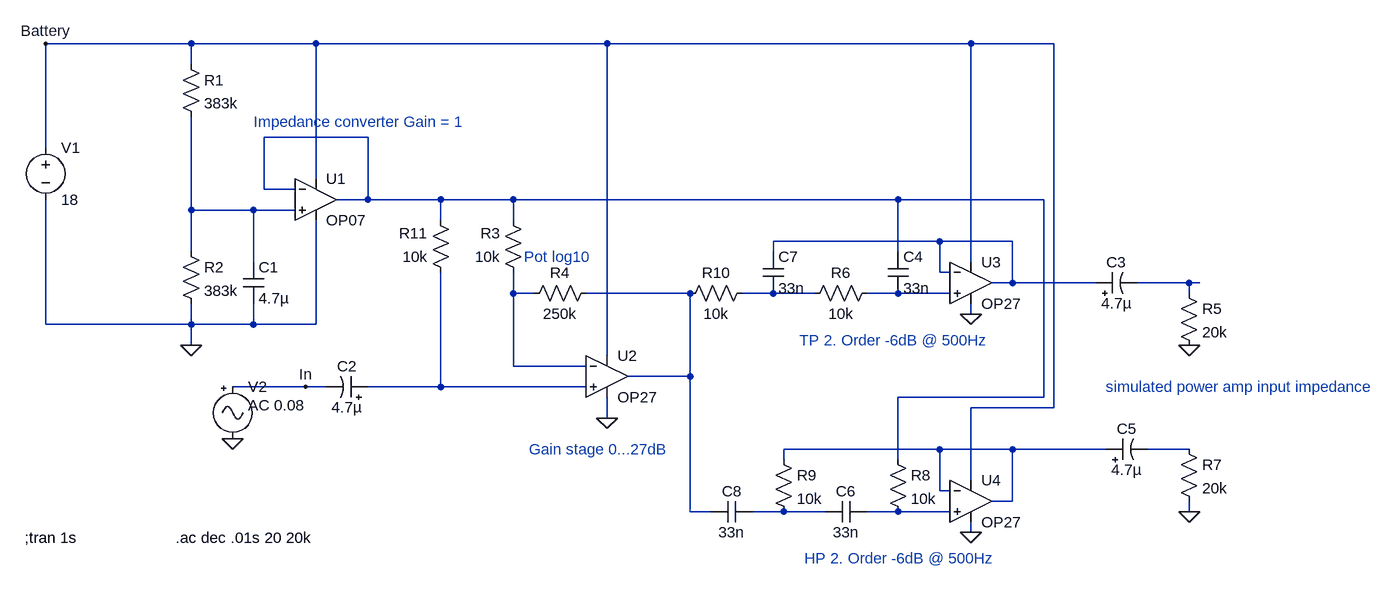
[diagram p0: schematic Preamp_HighLowPass2ndOrder_SMD.asc]
Preamp_HighLowPass2ndOrder_SMD.asc, the LTspice schematic file:
Version 4
SHEET 1 1816 680
WIRE -48 -624 -272 -624
WIRE 144 -624 -48 -624
WIRE 592 -624 144 -624
WIRE 1152 -624 592 -624
WIRE 1280 -624 1152 -624
WIRE -48 -592 -48 -624
WIRE 224 -480 64 -480
WIRE -272 -464 -272 -624
WIRE 144 -416 144 -624
WIRE 64 -400 64 -480
WIRE 112 -400 64 -400
WIRE 224 -384 224 -480
WIRE 224 -384 176 -384
WIRE 336 -384 224 -384
WIRE 448 -384 336 -384
WIRE 1040 -384 448 -384
WIRE 1264 -384 1040 -384
WIRE -48 -368 -48 -512
WIRE 48 -368 -48 -368
WIRE 112 -368 48 -368
WIRE 336 -352 336 -384
WIRE 448 -352 448 -384
WIRE 1104 -320 848 -320
WIRE 1216 -320 1104 -320
WIRE -48 -304 -48 -368
WIRE 848 -304 848 -320
WIRE 1040 -304 1040 -384
WIRE 48 -288 48 -368
WIRE 1152 -288 1152 -624
WIRE 1104 -272 1104 -320
WIRE 1120 -272 1104 -272
WIRE 1216 -256 1216 -320
WIRE 1216 -256 1184 -256
WIRE 1344 -256 1216 -256
WIRE 1488 -256 1408 -256
WIRE 1504 -256 1488 -256
WIRE 448 -240 448 -272
WIRE 480 -240 448 -240
WIRE 720 -240 560 -240
WIRE 848 -240 800 -240
WIRE 912 -240 848 -240
WIRE 1040 -240 992 -240
WIRE 1120 -240 1040 -240
WIRE 1488 -240 1488 -256
WIRE 1152 -208 1152 -224
WIRE -272 -192 -272 -384
WIRE -48 -192 -48 -224
WIRE -48 -192 -272 -192
WIRE 48 -192 48 -224
WIRE 48 -192 -48 -192
WIRE 144 -192 144 -352
WIRE 144 -192 48 -192
WIRE -48 -160 -48 -192
WIRE 592 -144 592 -624
WIRE 448 -128 448 -240
WIRE 560 -128 448 -128
WIRE 720 -112 720 -240
WIRE 720 -112 624 -112
WIRE 128 -96 16 -96
WIRE 160 -96 128 -96
WIRE 336 -96 336 -272
WIRE 336 -96 224 -96
WIRE 560 -96 336 -96
WIRE 1264 -80 1264 -384
WIRE 1264 -80 1040 -80
WIRE 1280 -64 1280 -624
WIRE 1280 -64 1152 -64
WIRE 592 -48 592 -80
WIRE 1104 0 864 0
WIRE 1216 0 1104 0
WIRE 1360 0 1216 0
WIRE 1488 0 1424 0
WIRE 864 16 864 0
WIRE 1040 16 1040 -80
WIRE 1152 48 1152 -64
WIRE 1104 64 1104 0
WIRE 1120 64 1104 64
WIRE 1216 80 1216 0
WIRE 1216 80 1184 80
WIRE 720 96 720 -112
WIRE 752 96 720 96
WIRE 864 96 816 96
WIRE 928 96 864 96
WIRE 1040 96 992 96
WIRE 1120 96 1040 96
WIRE 1488 96 1488 80
WIRE 1152 128 1152 112
FLAG -48 -160 0
FLAG 592 -48 0
FLAG 1152 -208 0
FLAG 16 -16 0
FLAG 1152 128 0
FLAG 1488 -160 0
FLAG 1488 96 0
FLAG -272 -624 Battery
FLAG 128 -96 In
SYMBOL res -64 -608 R0
SYMATTR InstName R1
SYMATTR Value 383k
SYMBOL res -64 -320 R0
SYMATTR InstName R2
SYMATTR Value 383k
SYMBOL voltage -272 -480 R0
SYMATTR InstName V1
SYMATTR Value 18
SYMBOL OpAmps\\OP07 144 -448 R0
SYMATTR InstName U1
SYMBOL cap 32 -288 R0
SYMATTR InstName C1
SYMATTR Value 4.7µ
SYMBOL res 464 -256 R180
WINDOW 0 36 76 Left 2
WINDOW 3 36 40 Left 2
SYMATTR InstName R3
SYMATTR Value 10k
SYMATTR SpiceLine tol=1 pwr=250m
SYMBOL res 576 -256 R90
WINDOW 0 0 56 VBottom 2
WINDOW 3 32 56 VTop 2
SYMATTR InstName R4
SYMATTR Value 250k
SYMBOL polcap 224 -80 M270
WINDOW 0 32 32 VTop 2
WINDOW 3 0 32 VBottom 2
SYMATTR InstName C2
SYMATTR Value 4.7µ
SYMBOL OpAmps\\OP27 592 -176 R0
SYMATTR InstName U2
SYMBOL OpAmps\\OP27 1152 -320 R0
SYMATTR InstName U3
SYMBOL res 1008 -256 R90
WINDOW 0 0 56 VBottom 2
WINDOW 3 32 56 VTop 2
SYMATTR InstName R6
SYMATTR Value 10k
SYMBOL cap 1024 -304 R0
SYMATTR InstName C4
SYMATTR Value 33n
SYMBOL OpAmps\\OP27 1152 16 R0
SYMATTR InstName U4
SYMBOL cap 992 80 R90
WINDOW 0 0 32 VBottom 2
WINDOW 3 32 32 VTop 2
SYMATTR InstName C6
SYMATTR Value 33n
SYMBOL res 1024 0 R0
SYMATTR InstName R8
SYMATTR Value 10k
SYMBOL Misc\\signal 16 -112 R0
WINDOW 123 24 44 Left 2
WINDOW 39 0 0 Left 0
SYMATTR Value2 AC 0.08
SYMATTR InstName V2
SYMATTR Value ""
SYMBOL res 1472 -256 R0
SYMATTR InstName R5
SYMATTR Value 20k
SYMBOL res 1472 -16 R0
SYMATTR InstName R7
SYMATTR Value 20k
SYMBOL polcap 1344 -240 R270
WINDOW 0 32 32 VTop 2
WINDOW 3 0 32 VBottom 2
SYMATTR InstName C3
SYMATTR Value 4.7µ
SYMBOL polcap 1360 16 R270
WINDOW 0 32 32 VTop 2
WINDOW 3 0 32 VBottom 2
SYMATTR InstName C5
SYMATTR Value 4.7µ
SYMBOL res 848 0 R0
SYMATTR InstName R9
SYMATTR Value 10k
SYMBOL res 816 -256 R90
WINDOW 0 0 56 VBottom 2
WINDOW 3 32 56 VTop 2
SYMATTR InstName R10
SYMATTR Value 10k
SYMBOL cap 832 -304 R0
SYMATTR InstName C7
SYMATTR Value 33n
SYMBOL cap 816 80 R90
WINDOW 0 0 32 VBottom 2
WINDOW 3 32 32 VTop 2
SYMATTR InstName C8
SYMATTR Value 33n
SYMBOL res 352 -256 R180
WINDOW 0 36 76 Left 2
WINDOW 3 36 40 Left 2
SYMATTR InstName R11
SYMATTR Value 10k
SYMATTR SpiceLine tol=1 pwr=250m
TEXT 464 -296 Left 2 ;Pot log10
TEXT -304 136 Left 2 !;tran 1s
TEXT -72 136 Left 2 !.ac dec .01s 20 20k
TEXT 48 -504 Left 2 ;Impedance converter Gain = 1
TEXT 888 -168 Left 2 ;TP 2. Order -6dB @ 500Hz
TEXT 896 168 Left 2 ;HP 2. Order -6dB @ 500Hz
TEXT 1360 -96 Left 2 ;simulated power amp input impedance
TEXT 472 0 Left 2 ;Gain stage 0...27dB

The netlist it stands for:
* Preamp_HighLowPass2ndOrder_SMD.asc
R1 Battery N002 383k
R2 N002 0 383k
V1 Battery 0 18
XU1 N002 N001 Battery 0 N001 LT1001  ; OP07, pins In+ In- V+ V- OUT
C1 N002 0 4.7µ
R3 N005 N001 10k tol=1 pwr=250m
R4 N006 N005 250k
C2 N009 In 4.7µ
XU2 N009 N005 Battery 0 N006 OP27  ; pins In+ In- V+ V- OUT
XU3 N008 N003 Battery 0 N003 OP27  ; pins In+ In- V+ V- OUT
R6 N008 N007 10k
C4 N001 N008 33n
XU4 N013 N010 Battery 0 N010 OP27  ; pins In+ In- V+ V- OUT
C6 N013 N012 33n
R8 N001 N013 10k
V2 In 0 AC 0.08
R5 N004 0 20k
R7 N011 0 20k
C3 N003 N004 4.7µ
C5 N010 N011 4.7µ
R9 N010 N012 10k
R10 N007 N006 10k
C7 N003 N007 33n
C8 N012 N006 33n
R11 N009 N001 10k tol=1 pwr=250m
* Pot log10
;tran 1s
.ac dec .01s 20 20k
* Impedance converter Gain = 1
* TP 2. Order -6dB @ 500Hz
* HP 2. Order -6dB @ 500Hz
* simulated power amp input impedance
* Gain stage 0...27dB
.lib LTC.lib
.lib ADI.lib
.backanno
.end